# EAGLE design Webasto (EAGLE 6.5.0)
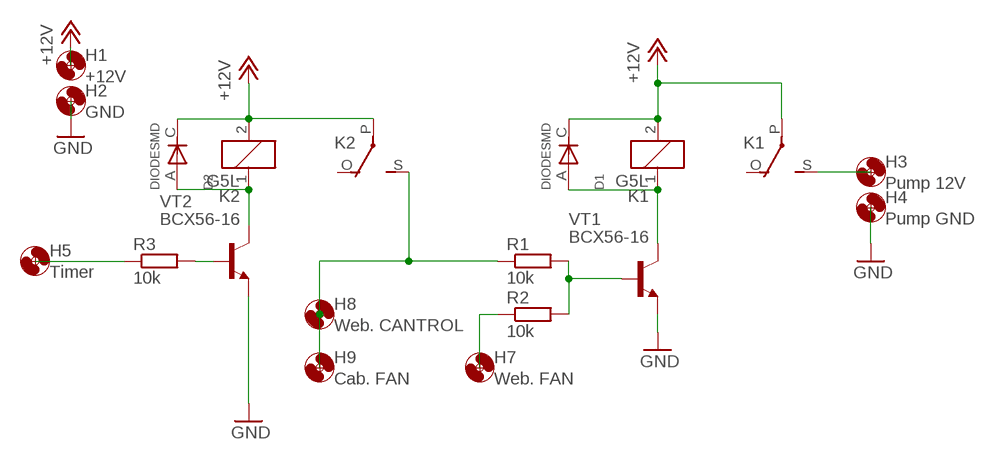
[diagram p0: schematic, sheet 1]

## Parts
D1  DIODESMD  [DO214AC]
D2  DIODESMD  [DO214AC]
H1  +12V  MOUNT-HOLE3.0  [3,0]
H2  GND  MOUNT-HOLE3.0  [3,0]
H3  Pump 12V  MOUNT-HOLE3.0  [3,0]
H4  Pump GND  MOUNT-HOLE3.0  [3,0]
H5  Timer  MOUNT-HOLE2.8  [2,8]
H7  Web. FAN  MOUNT-HOLE2.8  [2,8]
H8  Web. CANTROL  MOUNT-HOLE2.8  [2,8]
H9  Cab. FAN  MOUNT-HOLE2.8  [2,8]
K1  G5L  [G5LE]
K2  G5L  [G5LE]
R1  10k  R-EU_R0805  [R0805]
R2  10k  R-EU_R0805  [R0805]
R3  10k  R-EU_R0805  [R0805]
VT1  BCX56-16  [SOT89-BCE]
VT2  BCX56-16  [SOT89-BCE]

## Nets
+12V: D1.C(KATOD) D2.C(KATOD) H1.P$1 K1.2 K1.P(2:P) K2.2 K2.P(2:P)
GND: H2.P$1 H4.P$1 VT1.E VT2.E
N$1: H7.P$1 R2.1
N$2: D1.A(ANOD) K1.1 VT1.C VT1.C@1(C)
N$3: R1.2 R2.2 VT1.B
N$4: D2.A(ANOD) K2.1 VT2.C VT2.C@1(C)
N$5: R3.2 VT2.B
N$6: H8.P$1 H9.P$1 K2.S(2:S) R1.1
N$8: H5.P$1 R3.1
N$9: H3.P$1 K1.S(2:S)
Unconnected: K1.O(2:O) K2.O(2:O)

## Library data of the parts
D1 D2 = usb:DIODE: DIODE
H1-H5 H7-H9 = holes:MOUNT-HOLE: MOUNTING HOLE with drill center marker
K1 K2 = relay:G5L: RELAY 1 x switch, 10 A/120 V AC, 8 A/30 V ADC, Omron; OC_FARNELL: unknown; OC_NEWARK: unknown
R1-R3 = rcl:R-EU_: RESISTOR, European symbol
VT1 VT2 = usb:BCX56-16

## Board
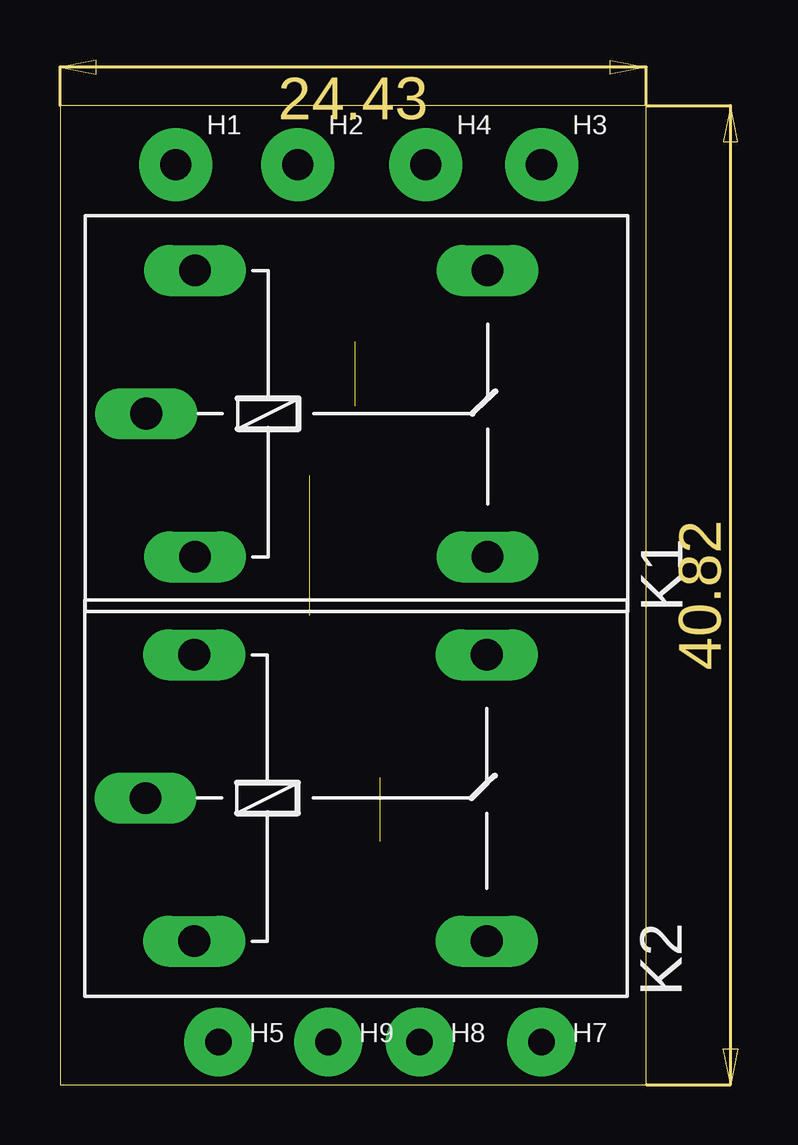
[diagram p1: board, top side]
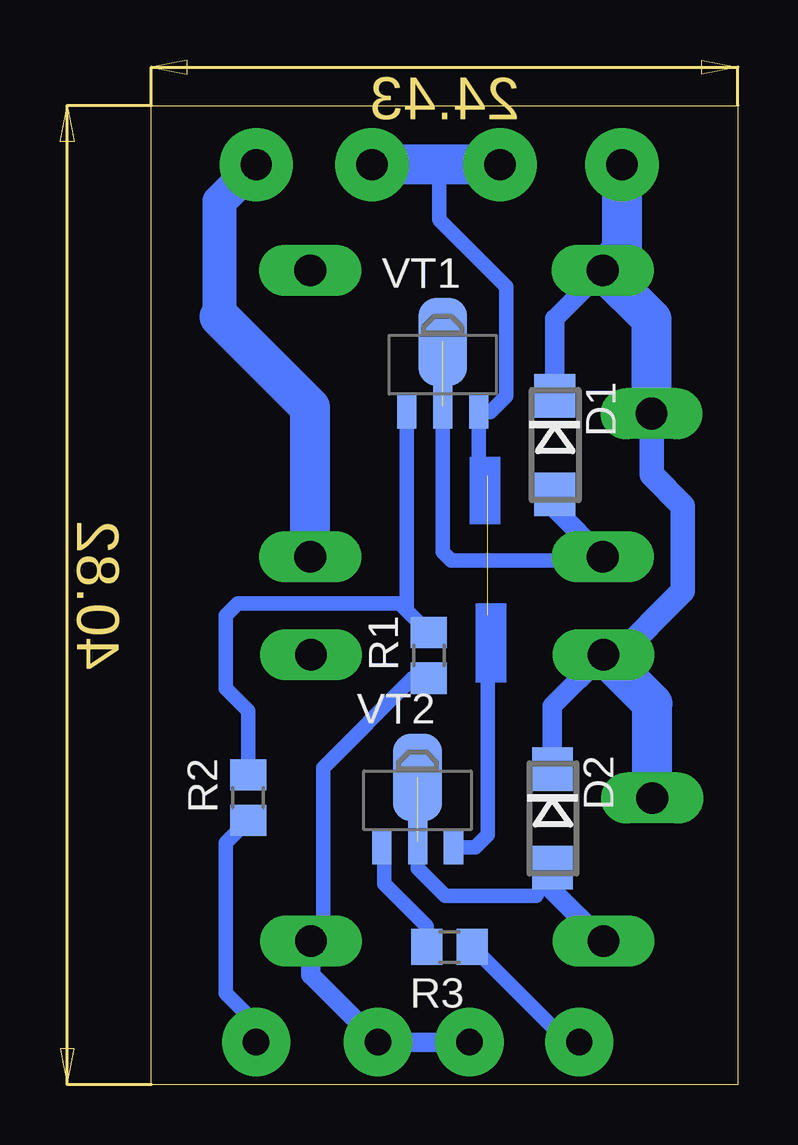
[diagram p2: board, bottom side, seen from below]

Size 24.43 x 40.82 mm. Coordinates in mm from the lower left corner, seen from the top.
Outline: 0,0 24.43,0 24.43,40.82 0,40.82 0,0
Copper layers (1*16): Top 0.035mm / dielectric 1.5mm / Bottom 0.035mm
Design rules "default": minimum track width 12mil, minimum drill 32mil, track to track 12mil, track to pad 12mil, pad to pad 12mil, via to via 12mil, smd to smd 8mil, copper to edge 40mil, drill to drill 8mil, minimum pad ring 16mil, minimum via ring 12mil, stop-mask expansion 4mil, vias tented up to drill 0mil, thermal gap 20mil

### Footprints (pad centres in the part's own frame; a part is rotated, then mirrored left to right if it is on the bottom)
DO214AC = smd 1.8 x 1.7: A 2.05,0; C -2.05,0
3,0 = drill 1.3 pad 3.048: P$1 0,0
2,8 = drill 1.1 pad 2.845: P$1 0,0
G5LE = drill 1.321 long: 1 -7.493,-5.969; 2 -7.493,5.969; O 4.699,5.969; P -9.525,0; S 4.699,-5.969
R0805 = smd 1.3 x 1.5: 1 -0.95,0; 2 0.95,0
SOT89-BCE = smd 0.8 x 1.4: B -1.499,-1.981; E 1.499,-1.981 | smd 0.8 x 1.9: C 0,-1.727 | smd 2.032 x 3.65: C@1 0,0.94

### Placement (x,y rotation side)
D1  7.63,26.66 270 bottom
D2  7.72,11.1 270 bottom
H1  4.83,38.35 0 top
H2  9.91,38.35 0 top
H3  20.07,38.35 0 top
H4  15.24,38.35 0 top
H5  6.6,1.78 0 top
H7  20.07,1.78 0 top
H8  14.99,1.78 0 top
H9  11.18,1.78 0 top
K1  13.12,27.98 0 top
K2  13.09,11.95 0 top
R1  12.87,17.9 90 bottom
R2  20.4,11.97 90 bottom
R3  12.01,5.74 180 bottom
VT1  12.3,30.03 0 bottom
VT2  13.34,11.87 0 bottom

### Tracks (layer width: path | path; a pad name or v marks a point on that pad's centre or on a via)
+12V
  Bottom 0.813: D1.C 7.63,31.94 K1.2 | D2.C 7.72,15.79 K2.2
  Bottom 1.016: K1.P 3.59,25.43 2.29,24.13 2.29,20.57 5.08,17.78 5.45,17.78 K2.2
  Bottom 1.676: K1.P 3.59,31.91 K1.2 4.83,34.74 H1.P$1 | 5.48,18.03 K2.2 3.56,15.89 K2.P
GND  (1 unrouted)
  Bottom 0.61: VT2.E 10.94,9.89 10.41,10.41 10.41,19.56 | 12.95,38.35 12.45,37.85 12.45,36.07 9.65,33.27 9.65,28.7 10.31,28.05 VT1.E 10.8,25.78 10.41,25.4
  Bottom 1.676: H2.P$1 12.95,38.35 H4.P$1
N$1
  Bottom 0.61: H7.P$1 20.07,2.54 21.34,3.81 21.34,10.09 R2.1
N$2  (1 unrouted)
  Bottom 0.61: 5.97,22.35 K1.1 5.79,21.84 11.94,21.84 12.3,22.2 VT1.C
  Bottom 0.813: D1.A 7.63,24.01 K1.1
N$3
  Bottom 0.61: VT1.B 13.79,19.77 | 13.79,19.77 R1.2 | R2.2 20.4,15.57 21.34,16.51 21.34,19.56 20.83,20.07 14.09,20.07 13.79,19.77
N$4  (1 unrouted)
  Bottom 0.61: VT2.C 13.34,9.02 12.19,7.87 8.39,7.87 D2.A
  Bottom 0.813: D2.A 7.72,8.11 K2.1
N$5
  Bottom 0.61: R3.2 12.96,6.61 14.73,8.38 14.73,9.78 VT2.B
N$6
  Bottom 0.61: R1.1 13.53,16.95 17.27,13.21 17.27,6.5 K2.S
  Bottom 0.813: K2.S 17.79,4.58 H8.P$1 H9.P$1
N$8
  Bottom 0.61: H5.P$1 7.09,1.78 R3.1
N$9
  Bottom 1.422: 21.59,32 21.59,36.83 H3.P$1
  Bottom 1.676: K1.S 17.82,28.23 21.59,32
(copper drawn outside any net)
  shapes: Bottom area x2